# EAGLE schematic Schematic (EAGLE 9.6.2)
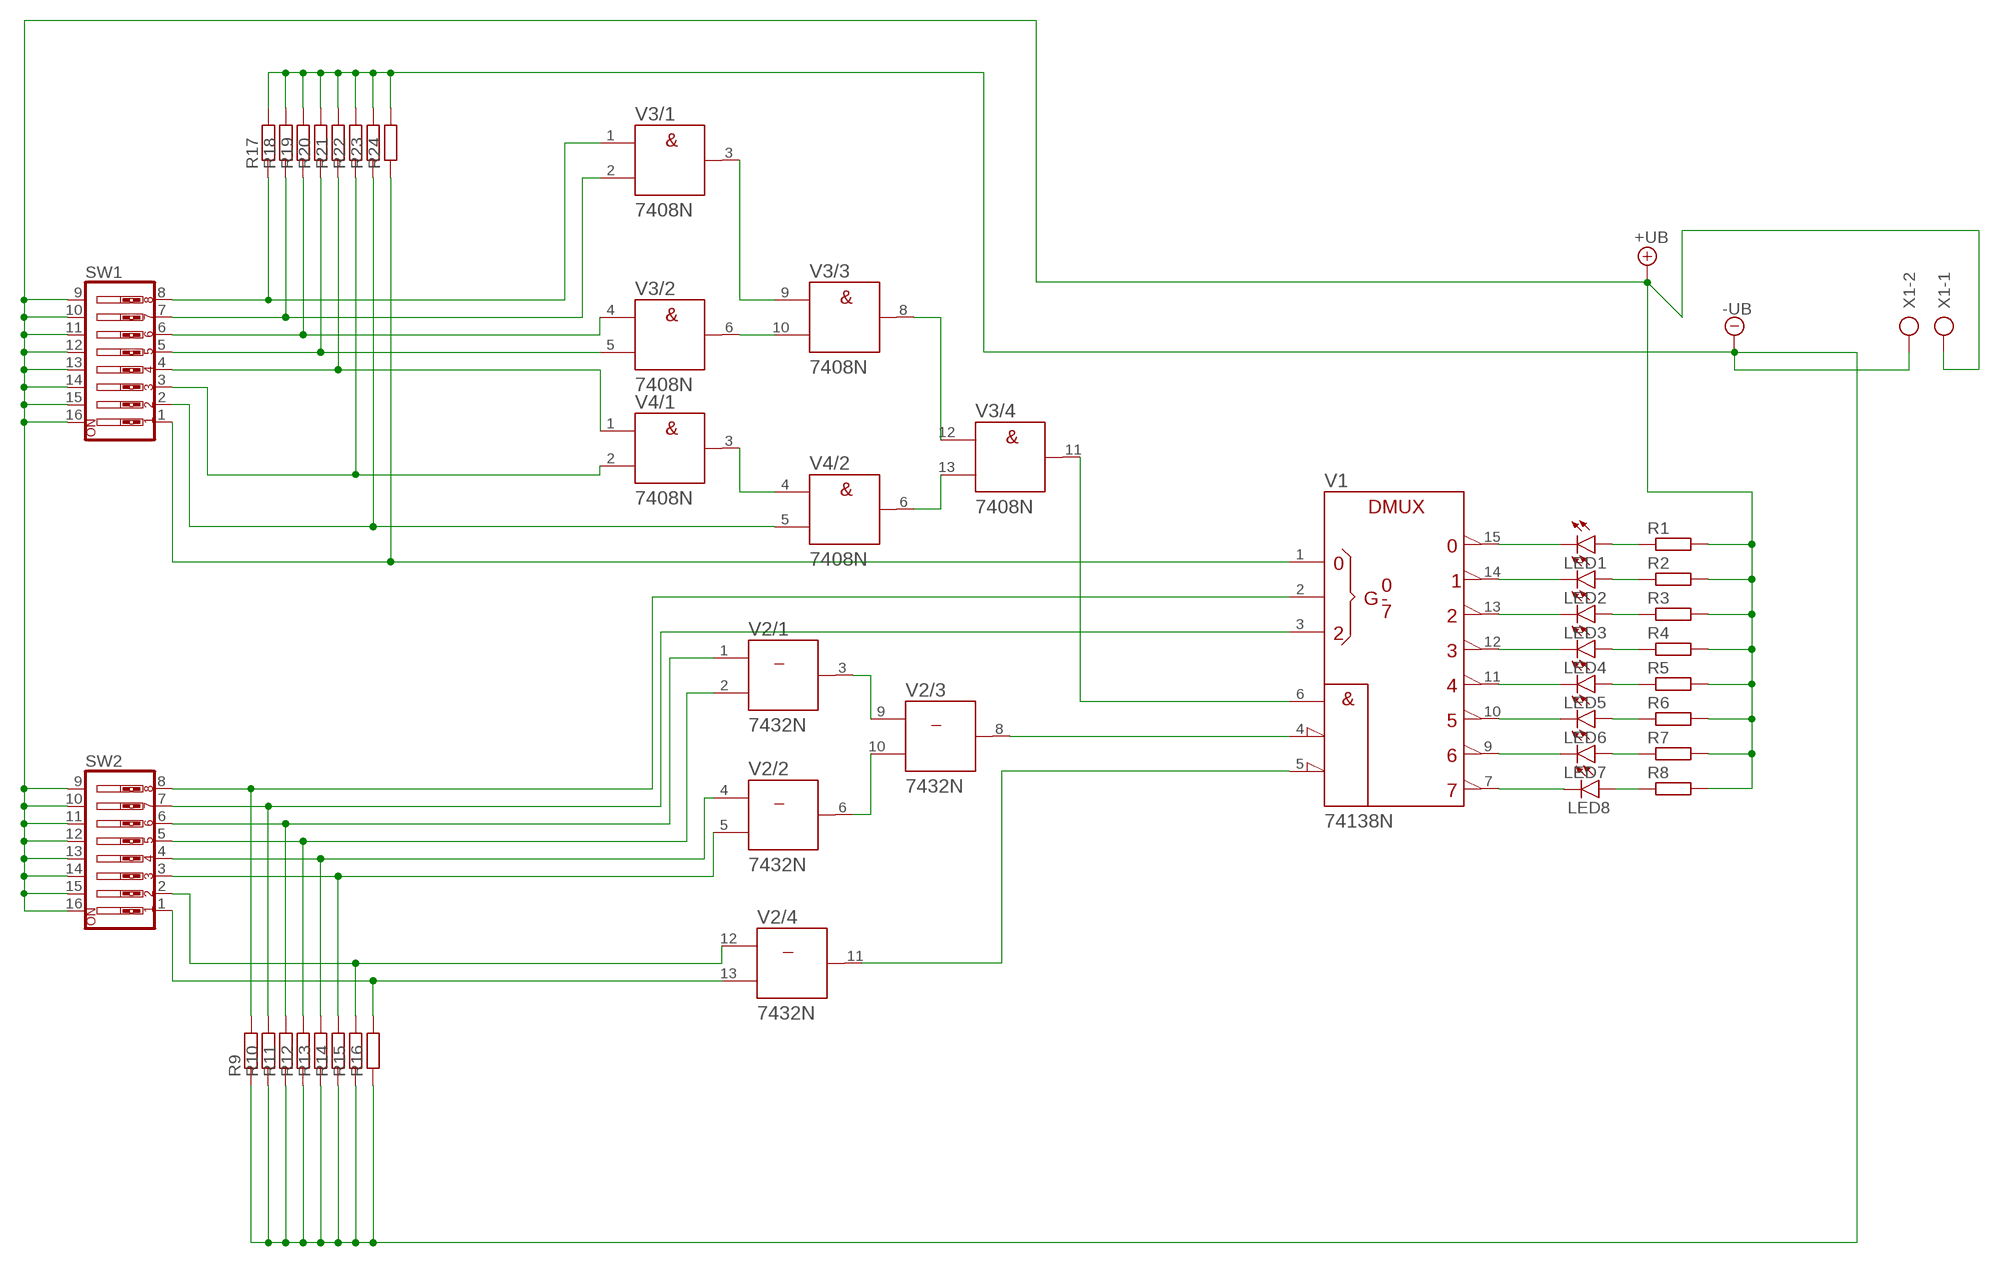
[diagram p0: schematic, sheet 1]

## Parts
LED1  LED5MM  [LED5MM]
LED2  LED5MM  [LED5MM]
LED3  LED5MM  [LED5MM]
LED4  LED5MM  [LED5MM]
LED5  LED5MM  [LED5MM]
LED6  LED5MM  [LED5MM]
LED7  LED5MM  [LED5MM]
LED8  LED5MM  [LED5MM]
R1  R-EU_0207/10  [0207/10]
R2  R-EU_0207/10  [0207/10]
R3  R-EU_0207/10  [0207/10]
R4  R-EU_0207/10  [0207/10]
R5  R-EU_0207/10  [0207/10]
R6  R-EU_0207/10  [0207/10]
R7  R-EU_0207/10  [0207/10]
R8  R-EU_0207/10  [0207/10]
R9  R-EU_0207/10  [0207/10]
R10  R-EU_0207/10  [0207/10]
R11  R-EU_0207/10  [0207/10]
R12  R-EU_0207/10  [0207/10]
R13  R-EU_0207/10  [0207/10]
R14  R-EU_0207/10  [0207/10]
R15  R-EU_0207/10  [0207/10]
R16  R-EU_0207/10  [0207/10]
R17  R-EU_0207/10  [0207/10]
R18  R-EU_0207/10  [0207/10]
R19  R-EU_0207/10  [0207/10]
R20  R-EU_0207/10  [0207/10]
R21  R-EU_0207/10  [0207/10]
R22  R-EU_0207/10  [0207/10]
R23  R-EU_0207/10  [0207/10]
R24  R-EU_0207/10  [0207/10]
SW1  SW_DIP-8  [EDG-08]
SW2  SW_DIP-8  [EDG-08]
V1  74138N  [DIL16]
V2  7432N  [DIL14]
V3  7408N  [DIL14]
V4  7408N  [DIL14]
X1  AK500/2  [AK500/2]

## Nets
+UB: R1.2 R2.2 R3.2 R4.2 R5.2 R6.2 R7.2 R8.2 SW1.9 SW1.10 SW1.11 SW1.12 SW1.13 SW1.14 SW1.15 SW1.16 SW2.9 SW2.10 SW2.11 SW2.12 SW2.13 SW2.14 SW2.15 SW2.16 X1.1
-UB: R9.1 R10.1 R11.1 R12.1 R13.1 R14.1 R15.1 R16.1 R17.2 R18.2 R19.2 R20.2 R21.2 R22.2 R23.2 R24.2 X1.2
N$1: V2.3(/1:Y) V2.9(/3:A)
N$2: V2.6(/2:Y) V2.10(/3:B)
N$3: V1.4(!G2A) V2.8(/3:Y)
N$4: V1.5(!G2B) V2.11(/4:Y)
N$5: V3.3(/1:Y) V3.9(/3:A)
N$6: V3.6(/2:Y) V3.10(/3:B)
N$7: V3.8(/3:Y) V3.12(/4:A)
N$8: V4.3(/1:Y) V4.4(/2:A)
N$9: V3.13(/4:B) V4.6(/2:Y)
N$10: V1.6(G1) V3.11(/4:Y)
N$11: R16.2 SW2.1 V2.13(/4:B)
N$12: R15.2 SW2.2 V2.12(/4:A)
N$13: R14.2 SW2.3 V2.5(/2:B)
N$14: R13.2 SW2.4 V2.4(/2:A)
N$15: R12.2 SW2.5 V2.2(/1:B)
N$16: R11.2 SW2.6 V2.1(/1:A)
N$17: R10.2 SW2.7 V1.3(C)
N$18: R9.2 SW2.8 V1.2(B)
N$19: R24.1 SW1.1 V1.1(A)
N$20: R23.1 SW1.2 V4.5(/2:B)
N$21: R22.1 SW1.3 V4.2(/1:B)
N$22: R21.1 SW1.4 V4.1(/1:A)
N$23: R20.1 SW1.5 V3.5(/2:B)
N$24: R19.1 SW1.6 V3.4(/2:A)
N$25: R18.1 SW1.7 V3.2(/1:B)
N$26: R17.1 SW1.8 V3.1(/1:A)
N$27: LED1.K(C) V1.15(Y0)
N$28: LED2.K(C) V1.14(Y1)
N$29: LED3.K(C) V1.13(Y2)
N$30: LED4.K(C) V1.12(Y3)
N$31: LED5.K(C) V1.11(Y4)
N$32: LED6.K(C) V1.10(Y5)
N$33: LED7.K(C) V1.9(Y6)
N$34: LED8.K(C) V1.7(Y7)
N$35: LED1.A R1.1
N$36: LED2.A R2.1
N$37: LED3.A R3.1
N$38: LED4.A R4.1
N$39: LED5.A R5.1
N$40: LED6.A R6.1
N$41: LED7.A R7.1
N$42: LED8.A R8.1
Unconnected: V4.8(/3:Y) V4.9(/3:A) V4.10(/3:B) V4.11(/4:Y) V4.12(/4:A) V4.13(/4:B)

## Power pins joined to a net without a drawn wire
+UB: V1.16(+UB) V2.14(/+UB:+UB) V3.14(/+UB:+UB) V4.14(/+UB:+UB)
-UB: V1.8(-UB) V2.7(/-UB:-UB) V3.7(/-UB:-UB) V4.7(/-UB:-UB)

## Library data of the parts
LED1-LED8 = led:LED: LED OSRAM: - CHIPLED LG R971, LG N971, LY N971, LG Q971, LY Q971, LO R971, LY R971 LH N974, LH R974 LS Q976, LO Q976, LY Q976 LO Q996 - Hyper CHIPLED LW Q18S LB Q993, LB Q99A, LB R99A - SideLED LS A670, LO A670, LY A670, LG A670, LP A670 LB A673, LV A673, LT A673, LW A673 LH A674 LY A675 LS A676, LA A676, LO A676, LY A676, LW A676 LS A679, LY A679, LG A679 - Hyper Micro SIDELED® LS Y876, LA Y876, LO Y876, LY Y876 LT Y87S - SmartLED LW L88C, LW L88S LB L89C, LB L89S, LG L890 LS L89K, LO L89K, LY L89K LS L896, LA L896, LO L896, LY L896 - TOPLED LS T670, LO T670, LY T670, LG T670, LP T670 LSG T670, LSP T670, LSY T670, LOP T670, LYG T670 LG T671, LOG T671, LSG T671 LB T673, LV T673, LT T673, LW T673 LH T674 LS T676, LA T676, LO T676, LY T676, LB T676, LH T676, LSB T676, LW T676 LB T67C, LV T67C, LT T67C, LS T67K, LO T67K, LY T67K, LW E67C LS E67B, LA E67B, LO E67B, LY E67B, LB E67C, LV E67C, LT E67C LW T67C LS T679, LY T679, LG T679 LS T770, LO T770, LY T770, LG T770, LP T770 LB T773, LV T773, LT T773, LW T773 LH T774 LS E675, LA E675, LY E675, LS T675 LS T776, LA T776, LO T776, LY T776, LB T776 LHGB T686 LT T68C, LB T68C - Hyper Mini TOPLED® LB M676 - Mini TOPLED Santana® LG M470 LS M47K, LO M47K, LY M47K Source: http://www.osram.convergy.de LUXEON: - LUMILED® LXK2-PW12-R00, LXK2-PW12-S00, LXK2-PW14-U00, LXK2-PW14-V00 LXK2-PM12-R00, LXK2-PM12-S00, LXK2-PM14-U00 LXK2-PE12-Q00, LXK2-PE12-R00, LXK2-PE12-S00, LXK2-PE14-T00, LXK2-PE14-U00 LXK2-PB12-K00, LXK2-PB12-L00, LXK2-PB12-M00, LXK2-PB14-N00, LXK2-PB14-P00, LXK2-PB14-Q00 LXK2-PR12-L00, LXK2-PR12-M00, LXK2-PR14-Q00, LXK2-PR14-R00 LXK2-PD12-Q00, LXK2-PD12-R00, LXK2-PD12-S00 LXK2-PH12-R00, LXK2-PH12-S00 LXK2-PL12-P00, LXK2-PL12-Q00, LXK2-PL12-R00 Source: www.luxeon.com KINGBRIGHT: KA-3528ASYC Source: www.kingbright.com
R1-R24 = rcl:R-EU_: RESISTOR, European symbol; SPICEPREFIX: R
SW1 SW2 = special:SW_DIP-8: DIP SWITCH
V1 = 74ttl-din:74*138: 3-line to 8-line DECODER/DEMULTIPLEXER
V2 = 74ttl-din:74*32: Quad 2-input OR gate
V3 V4 = 74ttl-din:74*08: Quad 2-input AND gate
X1 = con-ptr500:AK500/2: CONNECTOR; OC_FARNELL: unknown; OC_NEWARK: unknown